# Altium schematic sheet sch.SchDoc
size 209 x 297 mm
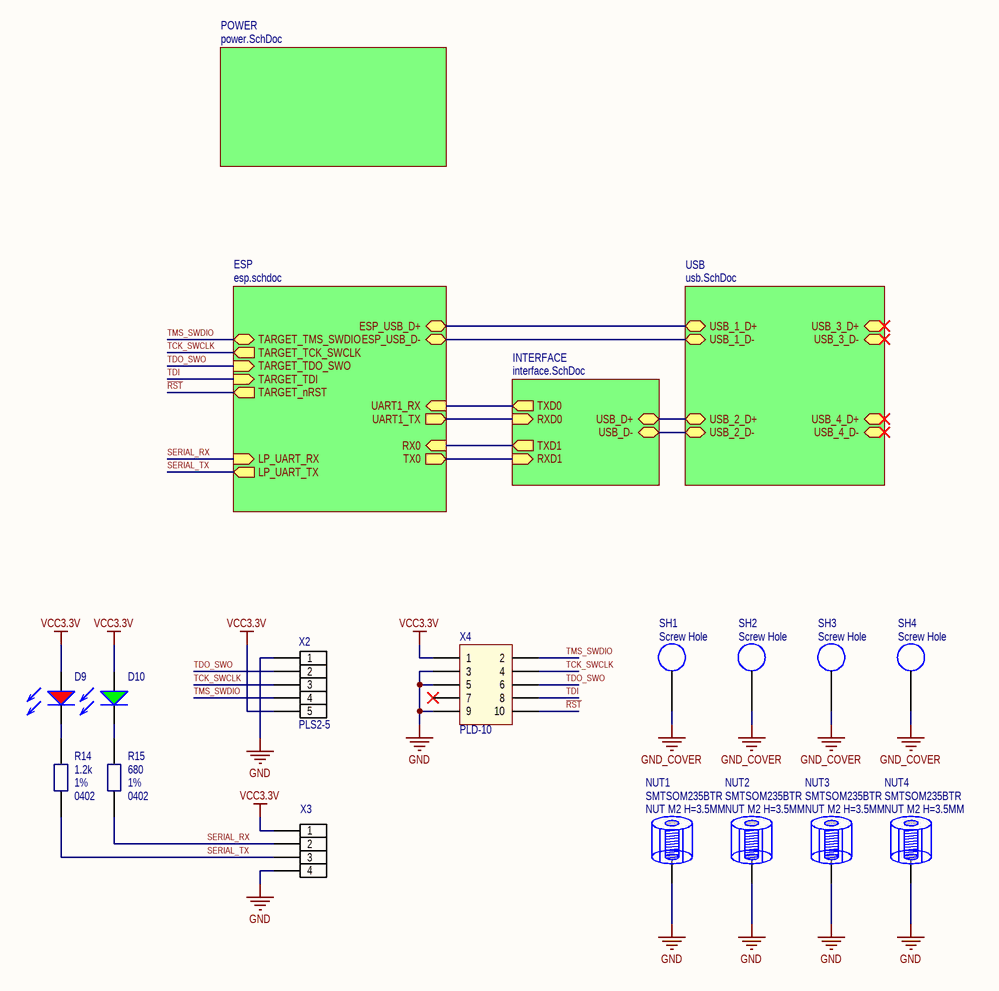
[diagram p0: sch.SchDoc]

## Parts
D9  Red 645nm  [LED 0603 RED, 60°]  (value not drawn)
D10  Emerald Green 515nm  [LED 0603 GREEN, 60°]  (value not drawn)
NUT1  SMTSOM235BTR  Case/Package: NUT M2 H=3.5MM  [SMTSOM235BTR]
NUT2  SMTSOM235BTR  Case/Package: NUT M2 H=3.5MM  [SMTSOM235BTR]
NUT3  SMTSOM235BTR  Case/Package: NUT M2 H=3.5MM  [SMTSOM235BTR]
NUT4  SMTSOM235BTR  Case/Package: NUT M2 H=3.5MM  [SMTSOM235BTR]
R14  value 1.2k  Case/Package: 0402  Tolerance: 1%  [R_0402]  (hidden comment: R0402)
R15  value 680  Case/Package: 0402  Tolerance: 1%  [R_0402]  (hidden comment: R0402)
SH1  Screw Hole  [Screw Hole 2.1mm/4.2mm]  (no BOM)
SH2  Screw Hole  [Screw Hole 2.1mm/4.2mm]  (no BOM)
SH3  Screw Hole  [Screw Hole 2.1mm/4.2mm]  (no BOM)
SH4  Screw Hole  [Screw Hole 2.1mm/4.2mm]  (no BOM)
X2  PLS2-5  [PLS-5T]
X3  PLS2-4  [PLS-4T]  (value not drawn)
X4  PLD-10  [PLD-10T]  (no BOM)

## Sub-sheets
ESP = esp.schdoc: TX0 (out), RX0 (in), LP_UART_TX (out), LP_UART_RX (in), ESP_USB_D+ (bidir), ESP_USB_D- (bidir), TARGET_TMS_SWDIO (bidir), TARGET_TCK_SWCLK (out), TARGET_TDO_SWO (in), TARGET_TDI (in), TARGET_nRST (out), UART1_TX (out), UART1_RX (in)
INTERFACE = interface.SchDoc: RXD0 (in), TXD0 (out), USB_D+ (bidir), USB_D- (bidir), TXD1 (out), RXD1 (in)
POWER = power.SchDoc: no entries
USB = usb.SchDoc: USB_3_D+ (bidir), USB_3_D- (bidir), USB_1_D+ (bidir), USB_1_D- (bidir), USB_2_D+ (bidir), USB_2_D- (bidir), USB_4_D+ (bidir), USB_4_D- (bidir)

## Nets
GND: NUT1.1(M3) NUT2.1(M3) NUT3.1(M3) NUT4.1(M3) X2.1 X3.4 X4.3 X4.5 X4.9
GND_COVER: SH1.1 SH2.1 SH3.1 SH4.1
VCC3.3V: D9.2 D10.2 X2.5 X3.1 X4.1
~{RST}: X4.10 ; sheet ESP/TARGET_nRST
SERIAL_RX: R15.1 X3.2 ; sheet ESP/LP_UART_RX
SERIAL_TX: R14.1 X3.3 ; sheet ESP/LP_UART_TX
TCK_SWCLK: X2.3 X4.4 ; sheet ESP/TARGET_TCK_SWCLK
TDI: X4.8 ; sheet ESP/TARGET_TDI
TDO_SWO: X2.2 X4.6 ; sheet ESP/TARGET_TDO_SWO
TMS_SWDIO: X2.4 X4.2 ; sheet ESP/TARGET_TMS_SWDIO
NetD9_1: D9.1 R14.2
NetD10_1: D10.1 R15.2
(unnamed): sheet ESP/TX0, sheet INTERFACE/RXD1
(unnamed): sheet ESP/RX0, sheet INTERFACE/TXD1
(unnamed): sheet ESP/ESP_USB_D+, sheet USB/USB_1_D+
(unnamed): sheet ESP/ESP_USB_D-, sheet USB/USB_1_D-
(unnamed): sheet ESP/UART1_TX, sheet INTERFACE/RXD0
(unnamed): sheet ESP/UART1_RX, sheet INTERFACE/TXD0
(unnamed): sheet USB/USB_2_D+, sheet INTERFACE/USB_D+
(unnamed): sheet USB/USB_2_D-, sheet INTERFACE/USB_D-

Not connected (* = marked no-connect by the designer): X4 7*

## Library data of the parts
D9 = RED-LED-0603: RED LED 0603, 60°; Part: APTD1608LSURCK; Color: Red 645nm; Alternative Part: *
D10 = GREEN LED 0603: GREEN LED 0603, 60°; Part: APTD1608ZGC; Alternative Part: *; Color: Emerald Green 515nm
NUT1-NUT4 = SMTSOM235BTR: NUT M2 H=3.5MM, Connector Standoff; Manufacturer: Sinhoo; Verified by ME: NO; Part: SMTSOM235BTR; Alternative Part: *; Pins: 1
R14 = R0402: Resistor; Part: RC0402FR-071K2L; Alternative Part: *
R15 = R0402: Resistor; Part: RC0402FR-07680RL; Alternative Part: *
X2 = PLS2-5: Header, 5-Pin; Part: X6511WRS-05H-C60D48; LatestRevisionDate: 17-Jul-2002; LatestRevisionNote: Re-released for DXP Platform.; Publisher: Altium Limited
X3 = PLS2-4: Header, 4-Pin; Part: X6511WRS-04H-C60D48; LatestRevisionDate: 17-Jul-2002; LatestRevisionNote: Re-released for DXP Platform.; Publisher: Altium Limited
X4 = PLD-10: male; PIN: 10; 2.54mm; Part: *
SH1-SH4 = Screw Hole: Pin Count: 1; Internal_PN: -